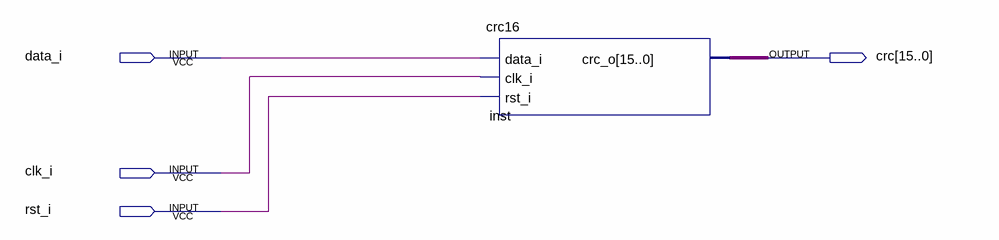
[diagram p0: schematic sheet]
// Quartus schematic top.bdf as structural Verilog: 1 symbols, 4 pins
module top (
  input  data_i,
  input  clk_i,
  input  rst_i,
  output [15:0] crc
);

  crc16 inst (.data_i(data_i), .clk_i(clk_i), .rst_i(rst_i), .crc_o(crc));
endmodule
